# EAGLE design tinyLarson (EAGLE 9.6.2)
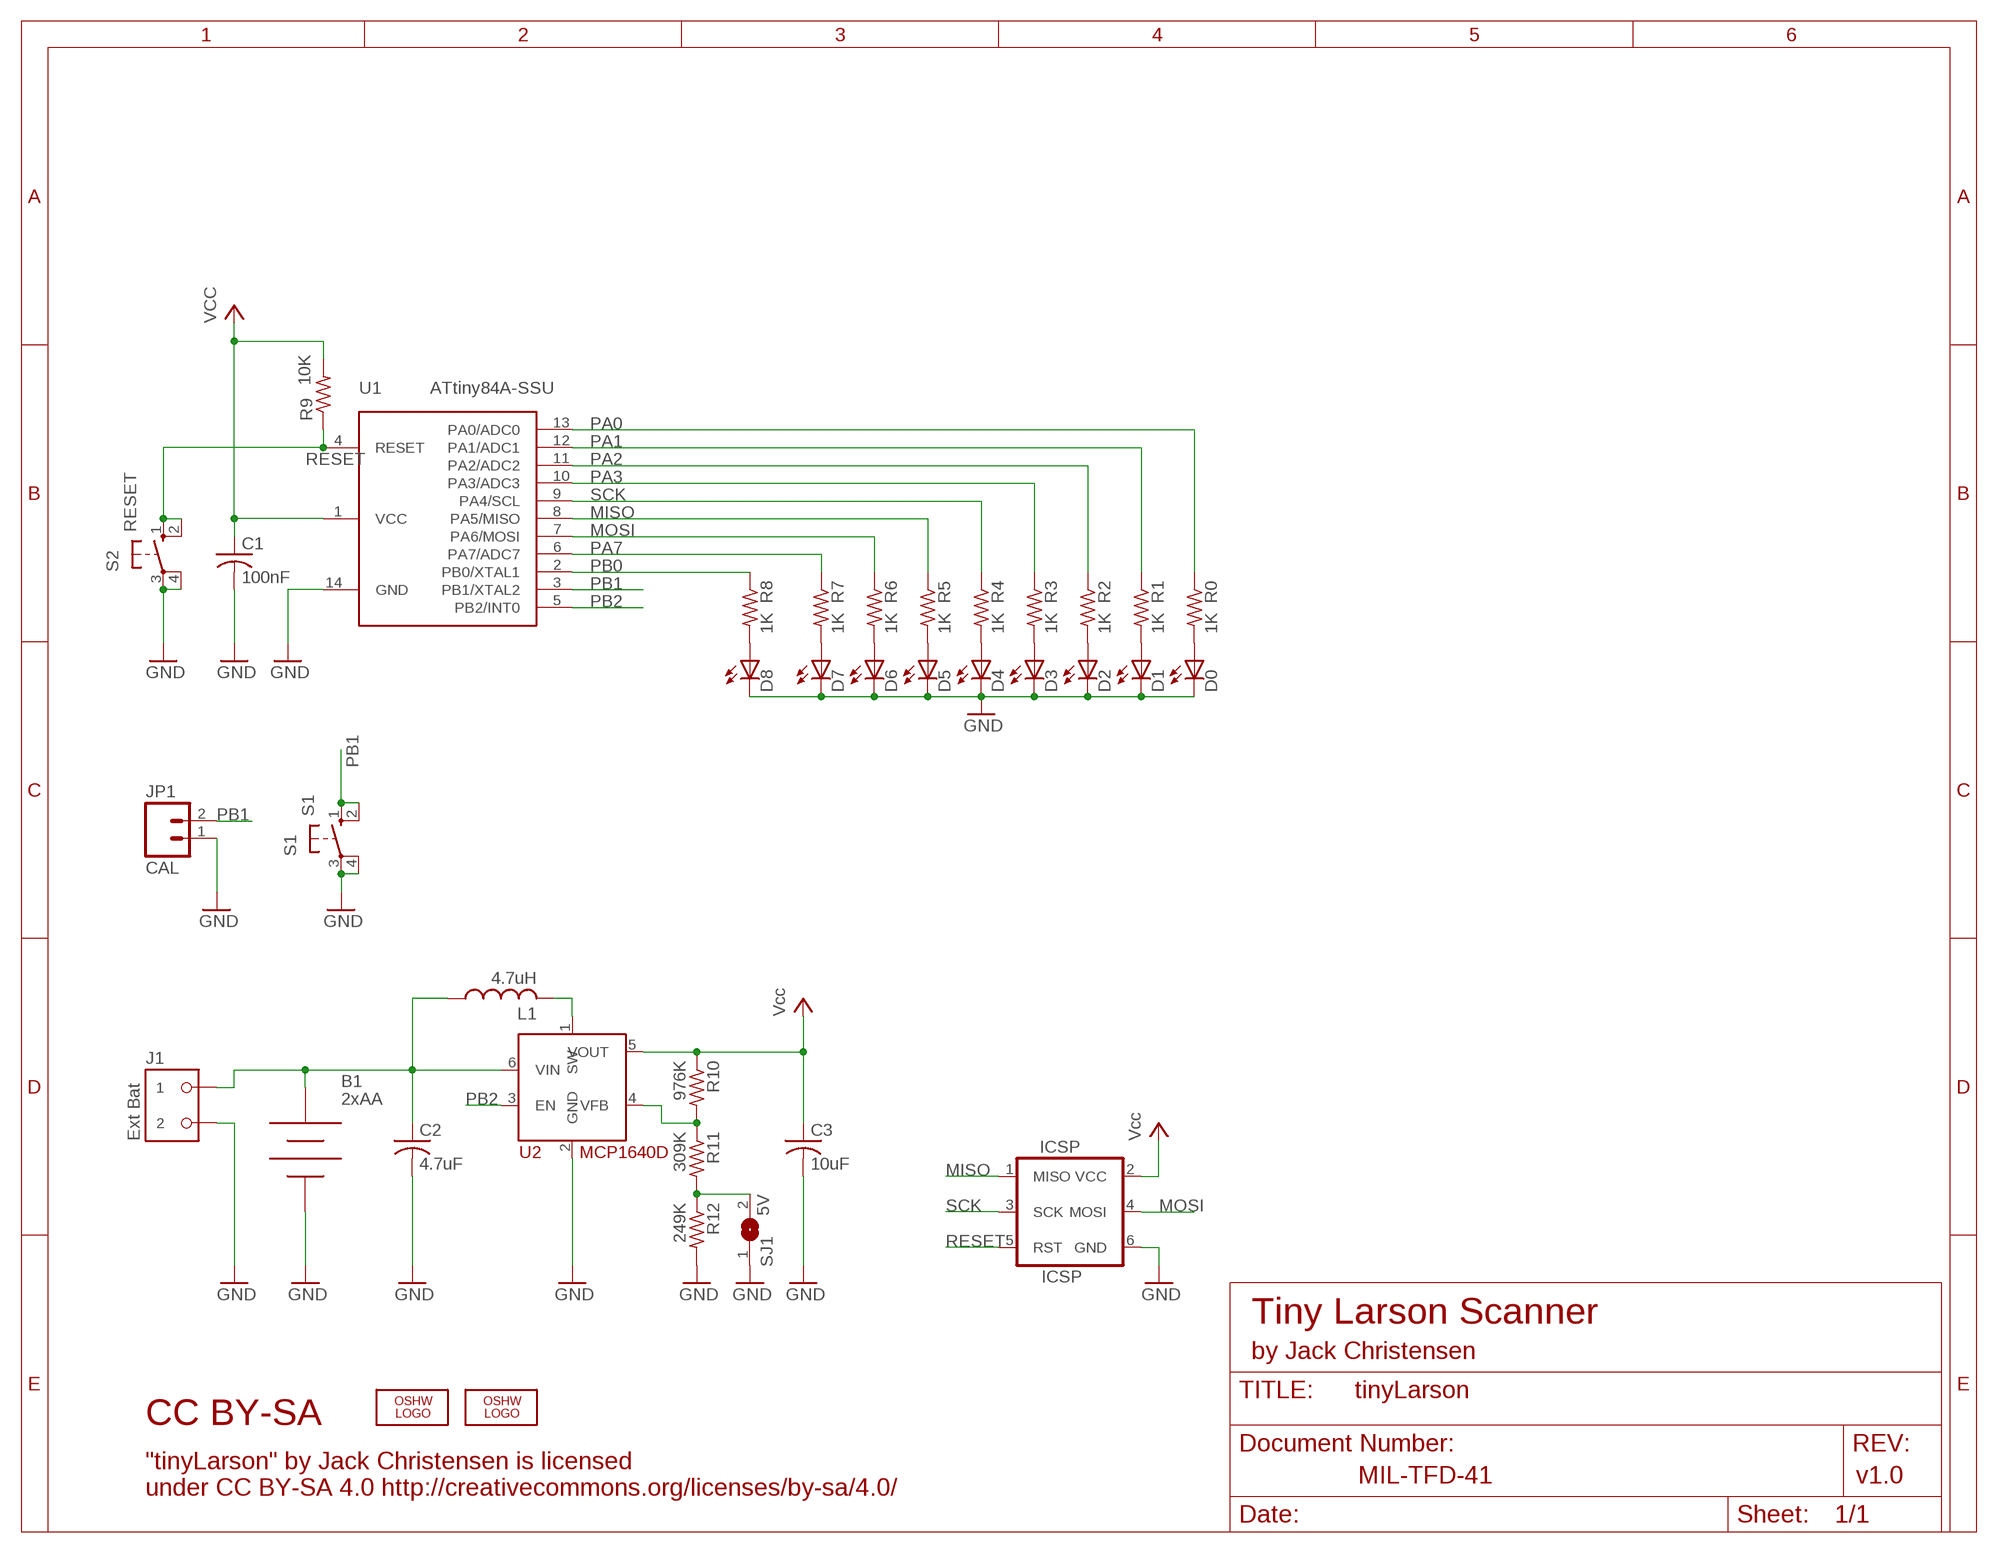
[diagram p0: schematic, sheet 1]

## Parts
B1  2xAA  BATTERY-2AAEAGLE  [EAGLE-12BH321P-GR]
C1  100nF  C-USM0805  [M0805]
C2  4.7uF  C-USM0805  [M0805]
C3  10uF  C-USM0805  [M0805]
D0  Yel  LEDD0805A  [D0805A]
D1  Yel  LEDD0805A  [D0805A]
D2  Yel  LEDD0805A  [D0805A]
D3  Yel  LEDD0805A  [D0805A]
D4  Yel  LEDD0805A  [D0805A]
D5  Yel  LEDD0805A  [D0805A]
D6  Yel  LEDD0805A  [D0805A]
D7  Yel  LEDD0805  [D0805]
D8  Red  LEDD0805  [D0805]
ICSP  ICSP  AVR_SPI_PRG_62X3_LOCK  [2X3_LOCK]
J1  Ext Bat  OST-TB-23.5MM  [OST-TB-2-3.5MM]
JP1  CAL  M02LOCK  [1X02_LOCK]
L1  4.7uH  INDUCTORC1210K  [C1210K]
LOGO1  OSHW_LOGO_8MILX0100-NT  [OSHW_8X100_NOTEXT]
LOGO2  OSHW_LOGO_8MILX0100-NT  [OSHW_8X100_NOTEXT]
R0  1K  R-US_M0805  [M0805]
R1  1K  R-US_M0805  [M0805]
R2  1K  R-US_M0805  [M0805]
R3  1K  R-US_M0805  [M0805]
R4  1K  R-US_M0805  [M0805]
R5  1K  R-US_M0805  [M0805]
R6  1K  R-US_M0805  [M0805]
R7  1K  R-US_M0805  [M0805]
R8  1K  R-US_M0805  [M0805]
R9  10K  R-US_M0805  [M0805]
R10  976K  R-US_M0805  [M0805]
R11  309K  R-US_M0805  [M0805]
R12  249K  R-US_M0805  [M0805]
S1  S1  10-XXOCT  [B3F-10XXOCT]
S2  RESET  10-XXOCT  [B3F-10XXOCT]
SJ1  5V  SJ  [SJ]
U1  ATtiny84A-SSU  ATTINYX4SO14  [SO14]
U2  MCP1640D  MCP1640  [SOT23-6]

## Nets
GND: B1.NEG C1.2 C2.2 C3.2 D0.K(C) D1.K(C) D2.K(C) D3.K(C) D4.K(C) D5.K(C) D6.K(C) D7.K(C) D8.K(C) ICSP.6(GND) J1.P$2 JP1.1 R12.2 S1.3(P) S1.4(P1) S2.3(P) S2.4(P1) SJ1.1 U1.14(GND) U2.2(GND)
MISO: ICSP.1(MISO) R5.1 U1.8(PA5/MISO)
MOSI: ICSP.4(MOSI) R6.1 U1.7(PA6/MOSI)
N$1: R11.2 R12.1 SJ1.2
N$2: R10.2 R11.1 U2.4(VFB)
N$3: D0.A R0.2
N$4: D1.A R1.2
N$5: D2.A R2.2
N$6: D3.A R3.2
N$7: L1.2 U2.1(SW)
N$8: D4.A R4.2
N$9: D5.A R5.2
N$10: D6.A R6.2
N$11: B1.POS C2.1 J1.P$1 L1.1 U2.6(VIN)
N$12: D7.A R7.2
N$13: D8.A R8.2
PA0: R0.1 U1.13(PA0/ADC0)
PA1: R1.1 U1.12(PA1/ADC1)
PA2: R2.1 U1.11(PA2/ADC2)
PA3: R3.1 U1.10(PA3/ADC3)
PA7: R7.1 U1.6(PA7/ADC7)
PB0: R8.1 U1.2(PB0/XTAL1)
PB1: JP1.2 S1.1(S) S1.2(S1) U1.3(PB1/XTAL2)
PB2: U1.5(PB2/INT0) U2.3(EN)
RESET: ICSP.5(RST) R9.1 S2.1(S) S2.2(S1) U1.4(RESET)
SCK: ICSP.3(SCK) R4.1 U1.9(PA4/SCL)
VCC: C1.1 C3.1 ICSP.2(VCC) R9.2 R10.1 U1.1(VCC) U2.5(VOUT) ; supply symbol labelled Vcc

## Notes on the sheet
- Tiny Larson Scanner
- by Jack Christensen
- CC BY-SA
- MIL-TFD-41 | v1.0
- "tinyLarson" by Jack Christensen is licensed
  under CC BY-SA 4.0 http://creativecommons.org/licenses/by-sa/4.0/

## Library data of the parts
B1 = _jc:BATTERY-2AA; MFR: Keystone; MFR-PART-NO: 2462
C1-C3 = _jc:C-US: CAPACITOR, American symbol
D0 D1-D8 = _jc:LED: LED OSRAM: - CHIPLED LG R971, LG N971, LY N971, LG Q971, LY Q971, LO R971, LY R971 LH N974, LH R974 LS Q976, LO Q976, LY Q976 LO Q996 - Hyper CHIPLED LW Q18S LB Q993, LB Q99A, LB R99A - SideLED LS A670, LO A670, LY A670, LG A670, LP A670 LB A673, LV A673, LT A673, LW A673 LH A674 LY A675 LS A676, LA A676, LO A676, LY A676, LW A676 LS A679, LY A679, LG A679 - Hyper Micro SIDELED® LS Y876, LA Y876, LO Y876, LY Y876 LT Y87S - SmartLED LW L88C, LW L88S LB L89C, LB L89S, LG L890 LS L89K, LO L89K, LY L89K LS L896, LA L896, LO L896, LY L896 - TOPLED LS T670, LO T670, LY T670, LG T670, LP T670 LSG T670, LSP T670, LSY T670, LOP T670, LYG T670 LG T671, LOG T671, LSG T671 LB T673, LV T673, LT T673, LW T673 LH T674 LS T676, LA T676, LO T676, LY T676, LB T676, LH T676, LSB T676, LW T676 LB T67C, LV T67C, LT T67C, LS T67K, LO T67K, LY T67K, LW E67C LS E67B, LA E67B, LO E67B, LY E67B, LB E67C, LV E67C, LT E67C LW T67C LS T679, LY T679, LG T679 LS T770, LO T770, LY T770, LG T770, LP T770 LB T773, LV T773, LT T773, LW T773 LH T774 LS E675, LA E675, LY E675, LS T675 LS T776, LA T776, LO T776, LY T776, LB T776 LHGB T686 LT T68C, LB T68C - Hyper Mini TOPLED® LB M676 - Mini TOPLED Santana® LG M470 LS M47K, LO M47K, LY M47K Source: http://www.osram.convergy.de/; MFR: Lite-On; MFR-PART-NO: LTST-C171KYKT
ICSP = _jc:AVR_SPI_PRG_6: AVR ISP 6 Pin This is the reduced ISP connector for AVR programming. Common on Arduino. This footprint will take up less PCB space and can be used with a 10-pin to 6-pin adapter such as SKU: BOB-08508
J1 = _jc:OST-TB-2
JP1 = SparkFun:M02: Header 2 Standard 2-pin 0.1" header. Use with straight break away headers (SKU : PRT-00116), right angle break away headers (PRT-00553), swiss pins (PRT-00743), machine pins (PRT-00117), and female headers (PRT-00115). Molex polarized connector foot print use with SKU : PRT-08233 with associated crimp pins and housings.
L1 = _jc:INDUCTOR: Murata #11R472C; MFR: Taiyo Yuden; MFR-PART-NO: CBC3225T4R7MR
LOGO1 LOGO2 = ohw-logo:OSHW_LOGO_8MIL
R0 R1-R12 = _jc:R-US_: RESISTOR, American symbol
S1 S2 = _jc:10-XX: OMRON SWITCH; MFR: Omron; MFR-PART-NO: B3FS-1000
SJ1 = jumper:SJ: SMD solder JUMPER
U1 = _jc:ATTINYX4
U2 = _jc:MCP1640

## Board
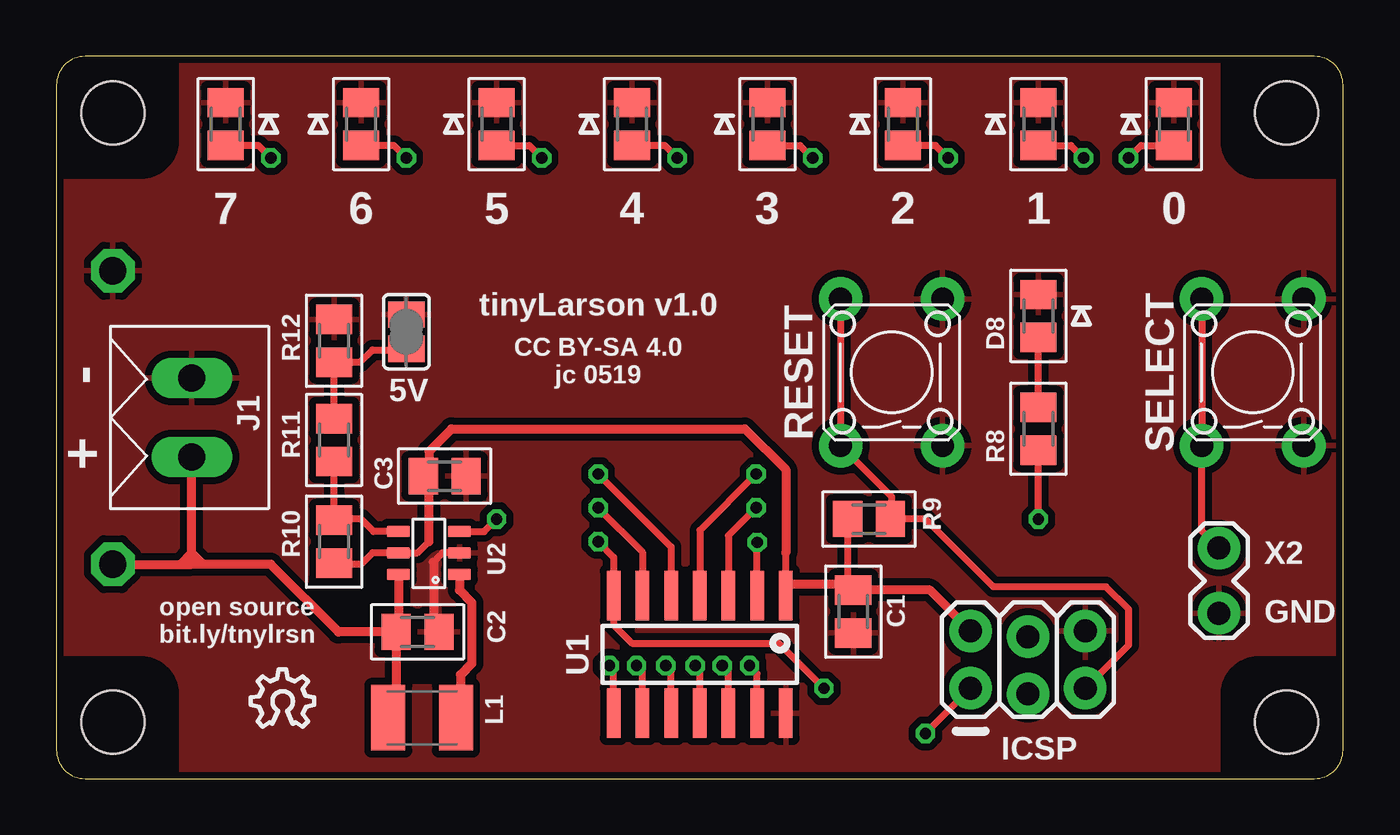
[diagram p1: board, top side]
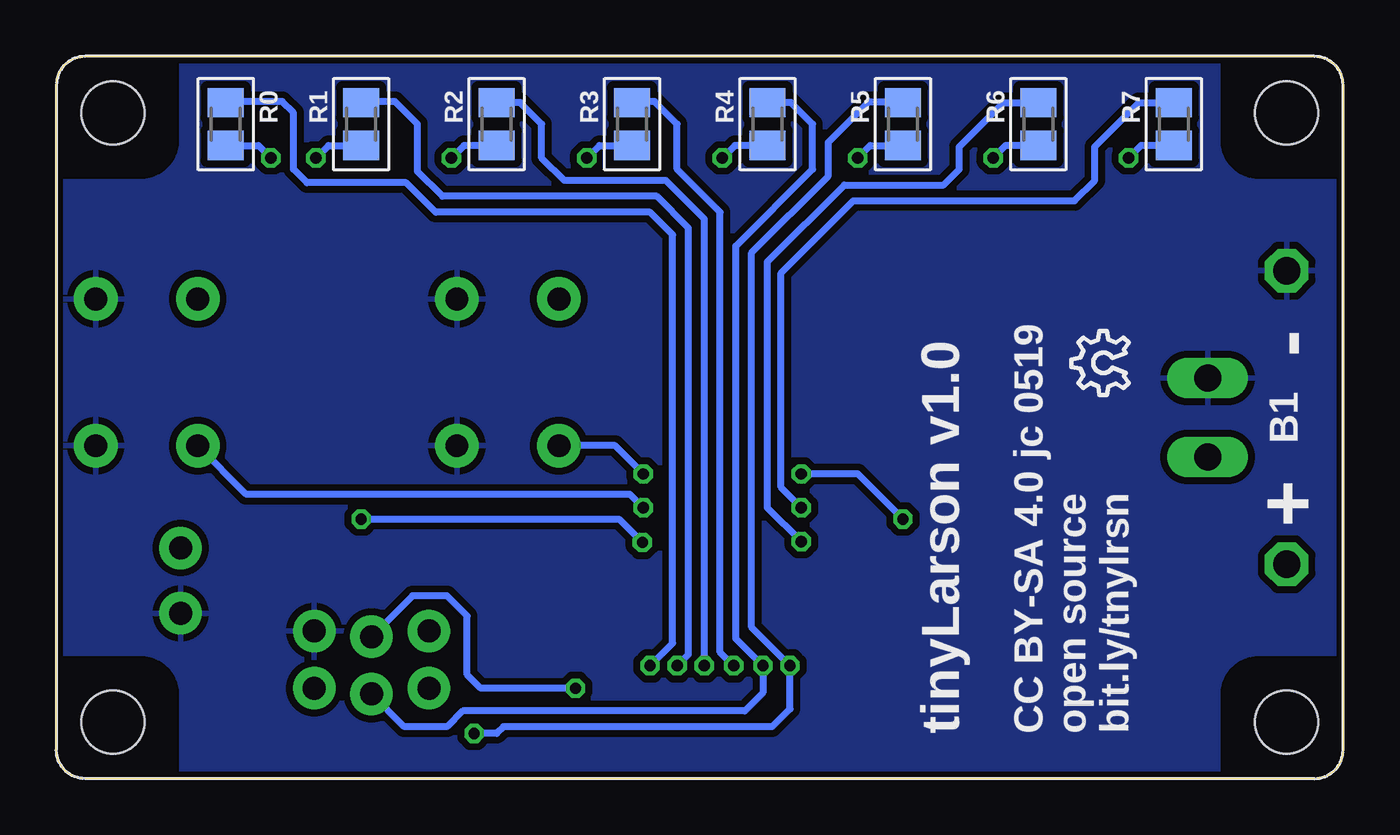
[diagram p2: board, bottom side, seen from below]

Size 57 x 32 mm. Coordinates in mm from the lower left corner, seen from the top.
Outline: 0,30.73 0,1.27 arc90 1.27,0 55.73,0 arc90 57,1.27 57,30.73 arc90 55.73,32 1.27,32 arc90 0,30.73
Copper layers (1*16): Top 0.0356mm / dielectric 1.5011mm / Bottom 0.0356mm
Design rules "oshpark-2layer-jc": minimum track width 8mil, minimum drill 13mil, track to track 8mil, track to pad 8mil, pad to pad 8mil, via to via 8mil, smd to smd 6mil, copper to edge 12mil, drill to drill 6mil, minimum pad ring 7mil, minimum via ring 7mil, stop-mask expansion 2.5mil, vias tented up to drill 20mil, thermal gap 12mil
Holes 2.8 mm at 2.5,2.5 2.5,29.5 54.5,29.5 54.5,2.5
tRestrict: area 15.5,4.5 to 17.5,5.5; area 0,27 to 5,32; area 0,0 to 5,5; area 52,0 to 57,5; area 52,27 to 57,32
bRestrict: area 0,27 to 5,32; area 0,0 to 5,5; area 52,27 to 57,32; area 52,0 to 57,5

### Footprints (pad centres in the part's own frame; a part is rotated, then mirrored left to right if it is on the bottom)
EAGLE-12BH321P-GR = drill 1.2 pad 1.93 octagon: NEG 2.5,9.5; POS 2.5,22.5
M0805 = smd 1.3 x 1.6: 1 -0.95,0; 2 0.95,0
D0805A = smd 1.3 x 1.6: A -0.95,0; K 0.95,0
D0805 = smd 1.3 x 1.6: A -0.95,0; K 0.95,0
2X3_LOCK = drill 1.016 pad 1.88: 1 0,0; 2 0,2.54; 3 2.54,-0.254; 4 2.54,2.286; 5 5.08,0; 6 5.08,2.54
OST-TB-2-3.5MM = drill 1.2 long: P$1 1.75,0; P$2 -1.75,0
1X02_LOCK = drill 1.016 pad 1.88: 1 -0.178,0; 2 2.718,0
C1210K = smd 1.5 x 2.9: 1 -1.5,0; 2 1.5,0
B3F-10XXOCT = drill 1.016 pad 1.93: 1 -3.251,2.261; 2 3.251,2.261; 3 -3.251,-2.261; 4 3.251,-2.261
SJ = smd 1.168 x 1.6: 1 -0.762,0; 2 0.762,0
SO14 = smd 0.6 x 2.2: 1 -3.81,-2.6; 2 -2.54,-2.6; 3 -1.27,-2.6; 4 0,-2.6; 5 1.27,-2.6; 6 2.54,-2.6; 7 3.81,-2.6; 8 3.81,2.6; 9 2.54,2.6; 10 1.27,2.6; 11 0,2.6; 12 -1.27,2.6; 13 -2.54,2.6; 14 -3.81,2.6
SOT23-6 = smd 0.508 x 1.016: 1 -0.95,-1.35; 2 0,-1.35; 3 0.95,-1.35; 4 0.95,1.35; 5 0,1.35; 6 -0.95,1.35

### Placement (x,y rotation side)
B1  0,32 180 bottom
C1  35.3,7.4 270 top
C2  16,6.5 0 top
C3  17.2,13.4 0 top
D0  49.5,29 90 top
D1  43.5,29 90 top
D2  37.5,29 90 top
D3  31.5,29 90 top
D4  25.5,29 90 top
D5  19.5,29 90 top
D6  13.5,29 90 top
D7  7.5,29 90 top
D8  43.5,20.5 90 top
ICSP  40.5,4 0 top
J1  6,16 270 top
JP1  51.5,7.5 90 top
L1  16.2,2.7 0 top
LOGO1  8.6,2.3 0 top
LOGO2  9.5,17 90 bottom
R0  49.5,29 270 bottom
R1  43.5,29 270 bottom
R2  37.5,29 270 bottom
R3  31.5,29 270 bottom
R4  25.5,29 270 bottom
R5  19.5,29 270 bottom
R6  13.5,29 270 bottom
R7  7.5,29 270 bottom
R8  43.5,15.5 90 top
R9  36,11.5 180 top
R10  12.3,10.5 90 top
R11  12.3,15 90 top
R12  12.3,19.4 90 top
S1  53,18 90 top
S2  37,18 90 top
SJ1  15.5,19.8 270 top
U1  28.5,5.5 180 top
U2  16.5,10 90 top

### Tracks (layer width: path | path; a pad name or v marks a point on that pad's centre or on a via)
GND
  Top 0.305: U2.2 17.1,10 16.7,9.6
  Top 0.406: 16.7,9.6 16.7,6.75 C2.2
  pour Top (isolate 0.305): -1.5,33.5 60.5,33.5 60.5,-1.5 -1.5,-1.5
  pour Bottom (isolate 0.305): -1,33 60,33 60,-1 -1,-1
MISO  (via drill 0.5)
  Top 0.305: U1.8 24.69,4.81 v24.5,5 | ICSP.1 v38.5,2
  Bottom 0.305: v38.5,2 37.5,2 37.2,2.3 25.29,2.3 24.5,3.09 v24.5,5 26.2,6.7 26.2,23.3 22.8,26.7 22.8,28.2 21,30 19.55,30 R5.1
MOSI  (via drill 0.5)
  Top 0.305: v34,4 32,6 25.5,6 24.69,6.81 U1.7 24.69,9.81 v24,10.5
  Bottom 0.305: v34,4 38.2,4 38.8,4.6 38.8,7.2 39.7,8.1 41.23,8.1 ICSP.4 | R6.1 15.05,29.95 17,28 17,27 17.7,26.3 22.1,26.3 25.5,22.9 25.5,12 v24,10.5
N$1
  Top 0.305: R11.2 R12.1 13.45,18.45 14,19 15.46,19 SJ1.2
N$2
  Top 0.305: U2.4 14.05,10.95 13.5,11.5 12.35,11.5 R10.2 R11.1
N$3  (via drill 0.5)
  Top 0.305: v47.5,27.5 48.05,28.05 D0.A
  Bottom 0.305: D0.A 48.05,28.05 v47.5,27.5
N$4  (via drill 0.5)
  Top 0.305: D1.A 44.95,28.05 v45.5,27.5
  Bottom 0.305: v45.5,27.5 44.95,28.05 D1.A
N$5  (via drill 0.5)
  Top 0.305: v39.5,27.5 38.95,28.05 D2.A
  Bottom 0.305: D2.A 38.95,28.05 v39.5,27.5
N$6  (via drill 0.5)
  Top 0.305: D3.A 32.95,28.05 v33.5,27.5
  Bottom 0.305: v33.5,27.5 32.95,28.05 D3.A
N$7
  Top 0.406: U2.1 17.85,8.35 18.4,7.8 18.4,5.1 17.9,4.6 17.9,2.9 L1.2
N$8  (via drill 0.5)
  Top 0.305: v27.5,27.5 26.95,28.05 D4.A
  Bottom 0.305: D4.A 26.95,28.05 v27.5,27.5
N$9  (via drill 0.5)
  Top 0.305: D5.A 20.95,28.05 v21.5,27.5
  Bottom 0.305: v21.5,27.5 20.95,28.05 D5.A
N$10  (via drill 0.5)
  Top 0.305: v15.5,27.5 14.95,28.05 D6.A
  Bottom 0.305: D6.A 14.95,28.05 v15.5,27.5
N$11
  Top 0.406: C2.1 15.05,3.05 L1.1 | 6,9.5 6,10 | 6,10 J1.P$1 | B1.POS 5.5,9.5 | 5.5,9.5 6,9.5 | U2.6 15.15,6.6 C2.1 | C2.1 12.5,6.5 9.5,9.5 6.5,9.5 | 6.5,9.5 6,9.5 | 6,10 5.5,9.5 | 6,10 6.5,9.5
N$12  (via drill 0.5)
  Top 0.305: v9.5,27.5 8.95,28.05 D7.A
  Bottom 0.305: D7.A 8.95,28.05 v9.5,27.5
N$13
  Top 0.305: R8.2 D8.A
PA0  (via drill 0.5)
  Top 0.305: U1.13 31.04,4.66 v30.7,5
  Bottom 0.305: v30.7,5 29.7,6 29.7,24.1 30.7,25.1 40.2,25.1 41.5,26.4 45.9,26.4 46.5,27 46.5,29.5 47,30 49.45,30 R0.1
PA1  (via drill 0.5)
  Top 0.305: U1.12 29.77,4.73 v29.5,5
  Bottom 0.305: v29.5,5 29,5.5 29,24.4 30.4,25.8 39.9,25.8 41,26.9 41,29 42,30 43.45,30 R1.1
PA2  (via drill 0.5)
  Top 0.305: U1.11 28.5,4.8 v28.3,5
  Bottom 0.305: v28.3,5 28.3,24.8 30,26.5 34.5,26.5 35.5,27.5 35.5,29 36.45,29.95 R2.1
PA3  (via drill 0.5)
  Top 0.305: U1.10 27.23,4.77 v27,5
  Bottom 0.305: v27,5 27.6,5.6 27.6,25.1 29.5,27 29.5,29 30.5,30 31.45,30 R3.1
PA7  (via drill 0.5)
  Top 0.305: 26,8.14 U1.6 25.96,10.04 v24,12
  Bottom 0.305: v24,12 24.9,12.9 24.9,22.4 21.7,25.6 11.9,25.6 11,26.5 11,28 9.05,29.95 R7.1
PB0  (via drill 0.5)
  Top 0.305: U1.2 v31.04,10.46 31,10.5 | v43.5,11.5 R8.1
  Bottom 0.305: v43.5,11.5 32.08,11.5 v31.04,10.46
PB1  (via drill 0.5)
  Top 0.305: S1.2 S1.1 50.74,10.98 JP1.2 | v31,12 29.77,10.77 U1.3
  Bottom 0.305: v31,12 31.6,12.6 48.59,12.6 S1.1
PB2  (via drill 0.5)
  Top 0.305: U2.3 18.95,10.95 v19.5,11.5 | v24,13.5 27.23,10.27 U1.5
  Bottom 0.305: v19.5,11.5 21.5,13.5 v24,13.5
RESET  (via drill 0.5)
  Top 0.305: ICSP.5 47.5,5.92 47.5,7.5 46.5,8.5 41.5,8.5 38.5,11.5 37.5,11.5 | 37.5,11.5 R9.1 | S2.2 S2.1 36.99,12.5 37,12.5 37,12 37.5,11.5 | v31,13.5 28.5,11 U1.4
  Bottom 0.305: v31,13.5 32.25,14.75 S2.1
SCK  (via drill 0.5)
  Top 0.305: U1.9 25.96,4.74 v25.7,5
  Bottom 0.305: ICSP.3 41.59,2.3 39.7,2.3 39,3 26.5,3 25.7,3.8 v25.7,5 26.9,6.2 26.9,23.6 23.5,27 23.5,29 24.45,29.95 R4.1
VCC
  Top 0.305: R10.1 12.35,9.5 13.5,9.5 14,10 U2.5 16,10 16.5,10.5 | U1.1 32.31,8.6 32.31,9 | 16.5,13.65 C3.1 | 32.36,8.95 32.31,9 | R9.2 35.05,8.6 C1.1 | 32.31,9 32.31,10
  Top 0.406: 16.5,10.5 16.5,13.15 C3.1 | 16.5,13.65 16.5,14.5 17.5,15.5 30.5,15.5 32.31,13.69 32.31,10 | 35.05,8.6 32.31,8.6 | ICSP.2 38.69,8.35 C1.1

### Text on the board
tPlace: 7 | 6 | 5 | 4 | 3 | 2 | 1 | 0 | tinyLarson v1.0 | - | CC BY-SA 4.0 / jc 0519 | RESET | SELECT | 5V | + | X2 | GND | open source / bit.ly/tnylrsn
bPlace: CC BY-SA 4.0 jc 0519 / open source / bit.ly/tnylrsn | tinyLarson v1.0